# EAGLE schematic mobo (EAGLE 6.6.0)
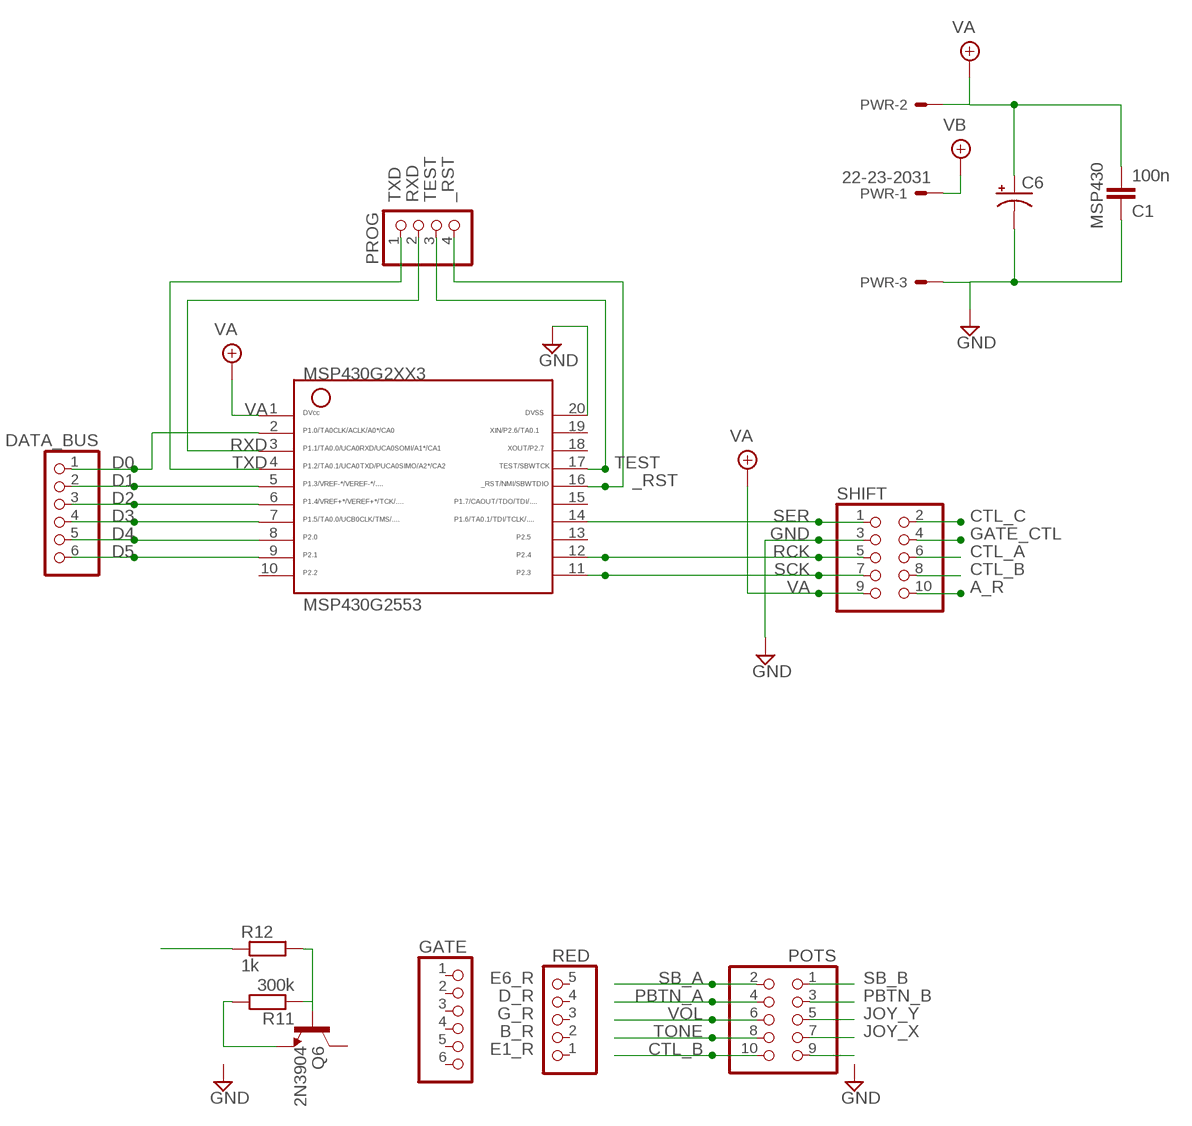
[diagram p0: schematic, sheet 1]

## Parts
C1  100n  050X030_050  [050X030_050_3]
C6  0501  [050_020_1]
DATA_BUS  PINHD-1X6  [1X06]
GATE  PINHD-1X6  [1X06]
MSP430G2553  G2XX3---N20  [N20]
POTS  PINHD-2X5  [2X05]
PROG  PINHD-1X4  [1X04]
PWR  22-23-2031  [22-23-2031]
Q6  2N3904  [TO92-]
R11  300k  6MM-EU1  [R0207/1V]
R12  1k  6MM-EU1  [R0207/1V]
RED  PINHD-1X5  [1X05]
SHIFT  PINHD-2X5  [2X05]

## Nets
_RST: MSP430G2553.16 PROG.4
CTL_A: SHIFT.6
CTL_B: SHIFT.8
CTL_C: SHIFT.2
D0: DATA_BUS.1 MSP430G2553.2 SHIFT.10
D1: DATA_BUS.2 MSP430G2553.5
D2: DATA_BUS.3 MSP430G2553.6
D3: DATA_BUS.4 MSP430G2553.7
D4: DATA_BUS.5 MSP430G2553.8
D5: DATA_BUS.6 MSP430G2553.9
GATE_CTL: SHIFT.4
GND: C1.1 C6.- MSP430G2553.20 PWR.3 SHIFT.3
N$1: Q6.2(B) R11.1 R12.2
N$2: POTS.10
N$3: POTS.7
N$4: POTS.8
N$5: POTS.6
N$6: POTS.4
N$7: POTS.2
N$8: POTS.5
N$9: POTS.3
N$10: POTS.1
N$11: POTS.9
N$12: Q6.3(E) R11.2
RCK: MSP430G2553.12 SHIFT.5
RXD: MSP430G2553.3 PROG.2
SB_2: R12.1
SCK: MSP430G2553.11 SHIFT.7
SER: MSP430G2553.14 SHIFT.1
TEST: MSP430G2553.17 PROG.3
TXD: MSP430G2553.4 PROG.1
VA: C1.2 C6.+ MSP430G2553.1 PWR.2 SHIFT.9
VB: PWR.1
Unconnected: GATE.1 GATE.2 GATE.3 GATE.4 GATE.5 GATE.6 MSP430G2553.10 MSP430G2553.13 MSP430G2553.15 MSP430G2553.18 MSP430G2553.19 Q6.1(C) RED.1 RED.2 RED.3 RED.4 RED.5

## Notes on the sheet
- MSP430
- A_R
- E6_R | SB_A | SB_B
- D_R | PBTN_A | PBTN_B
- G_R | VOL | JOY_Y
- B_R | TONE | JOY_X
- E1_R | CTL_B

## Library data of the parts
C1 = gm-caps-ceramic:050X030_050: 120 - 150pF Xicon Ceramic Disc 5mm lead spacing
C6 = gm-caps-electro-pol:050: 0.22 - 100uF Xicon values at Mouser.com: 10V: 10 - 100uF; 16V: 2.2 - 47uF; 25V: 0.47 - 47uF; 50V: 0.22 - 22uF
DATA_BUS GATE = pinhead:PINHD-1X6: PIN HEADER
MSP430G2553 = TI_MSP430_v16:G2XX3---N20: MSP430G2XX1 PDIP (N) 20 Pin Package
POTS SHIFT = pinhead:PINHD-2X5: PIN HEADER
PROG = pinhead:PINHD-1X4: PIN HEADER
PWR = jaapie:22-23-2031: .100" (2.54mm) Center Header - 3 Pin; MF: MOLEX; MPN: 22-23-2031; OC_FARNELL: 1462950; OC_NEWARK: 30C0862
Q6 = gm-trans:2N3904: NPN Transistor
R11 R12 = gm-resistors:6MM-EU: 6mm Resistors (European schematic symbol) Leads spaced 1-6 holes apart for 0.1" perfboard. Suitable for 1/4 watt resistors.
RED = pinhead:PINHD-1X5: PIN HEADER